# Altium schematic sheet MCU.SchDoc
size A4; SheetNumber: 1; SheetTotal: 5
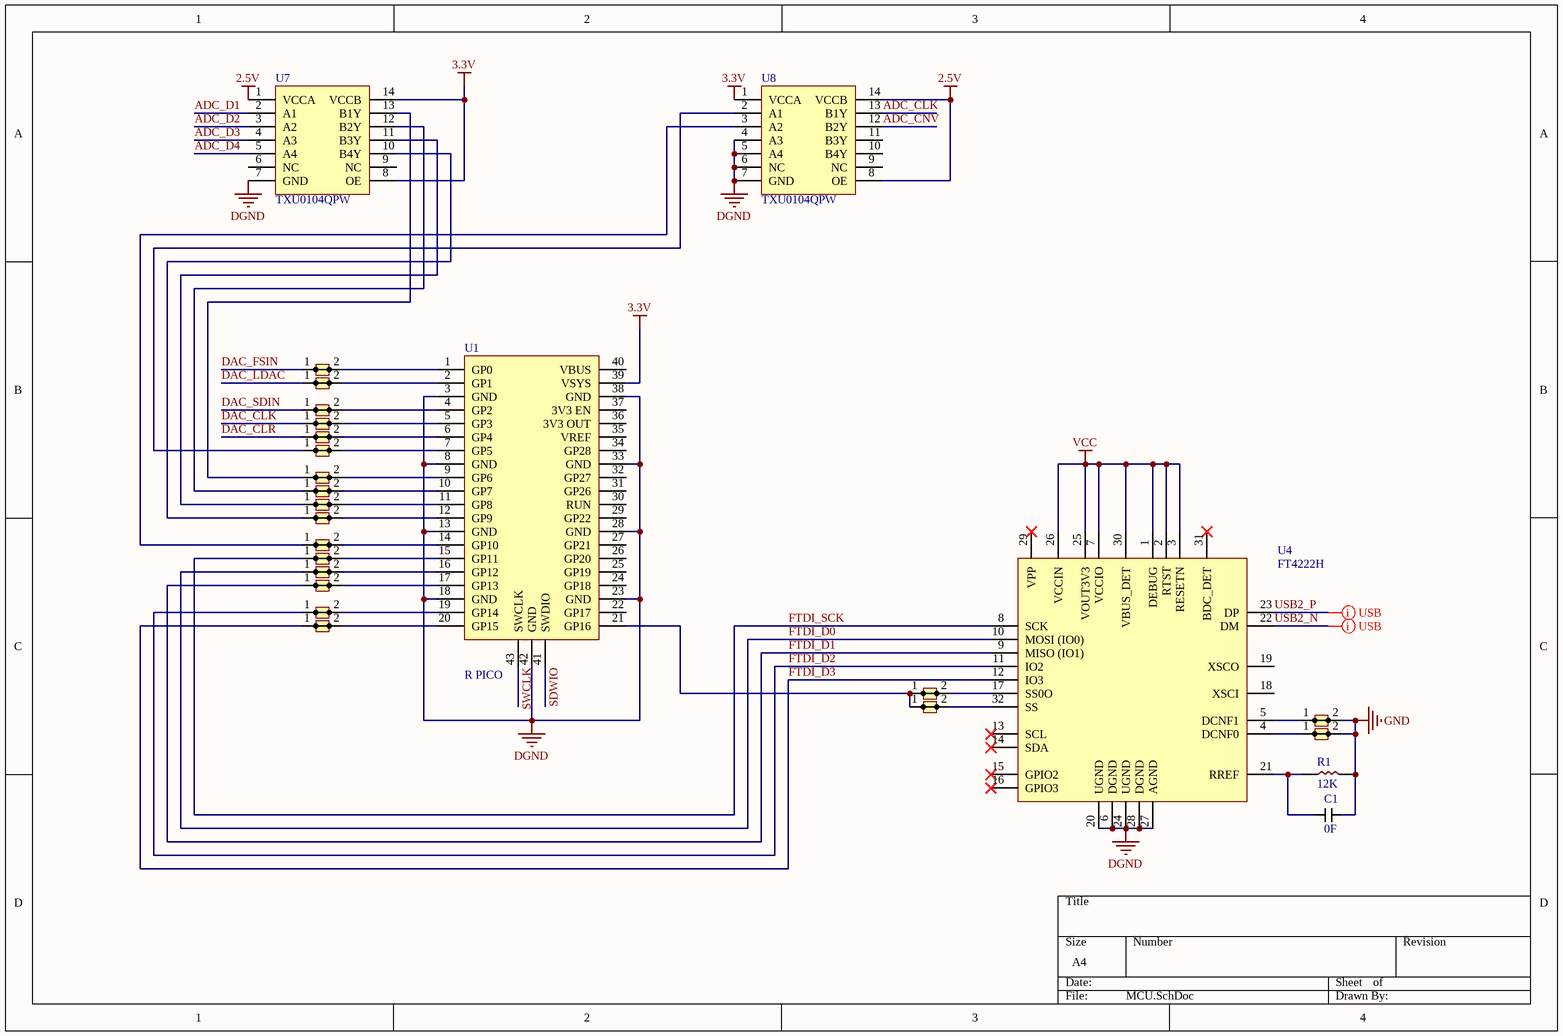
[diagram p0: MCU.SchDoc]

## Parts
C1  0F  [C0805]
R1  12K  [R0805]
SB1  SolderBridge  [SB]  (value not drawn)
SB2  SolderBridge  [SB]  (value not drawn)
SB3  SolderBridge  [SB]  (value not drawn)
SB4  SolderBridge  [SB]  (value not drawn)
SB5  SolderBridge  [SB]  (value not drawn)
SB6  SolderBridge  [SB]  (value not drawn)
SB7  SolderBridge  [SB]  (value not drawn)
SB8  SolderBridge  [SB]  (value not drawn)
SB9  SolderBridge  [SB]  (value not drawn)
SB10  SolderBridge  [SB]  (value not drawn)
SB11  SolderBridge  [SB]  (value not drawn)
SB12  SolderBridge  [SB]  (value not drawn)
SB13  SolderBridge  [SB]  (value not drawn)
SB14  SolderBridge  [SB]  (value not drawn)
SB15  SolderBridge  [SB]  (value not drawn)
SB16  SolderBridge  [SB]  (value not drawn)
SB17  SolderBridge  [SB]  (value not drawn)
SB18  SolderBridge  [SB]  (value not drawn)
SB19  SolderBridge  [SB]  (value not drawn)
SB20  SolderBridge  [SB]  (value not drawn)
U1  R PICO  [RPICO]
U4  FT4222H  [QFN-32]
U7  TXU0104QPW  [TSOP-14]
U8  TXU0104QPW  [TSOP-14]

## Nets
2.5V: U7.1(VCCA) U8.8(OE) U8.14(VCCB)
3.3V: U1.39(VSYS) U7.8(OE) U7.14(VCCB) U8.1(VCCA)
DGND: U1.3(GND) U1.8(GND) U1.13(GND) U1.18(GND) U1.23(GND) U1.28(GND) U1.33(GND) U1.38(GND) U1.42(GND) U4.6(DGND) U4.20(UGND) U4.24(UGND) U4.27(AGND) U4.28(DGND) U7.7(GND) U8.4(A3) U8.5(A4) U8.6(NC) U8.7(GND)
GND: C1.2 R1.2 SB19.2 SB20.2
VCC: U4.1(DEBUG) U4.2(RTST) U4.3(RESETN) U4.7(VCCIO) U4.25(VOUT3V3) U4.26(VCCIN) U4.30(VBUS_DET)
ADC_CLK: U8.13(B1Y)
ADC_CNV: U8.12(B2Y)
ADC_D1: U7.2(A1)
ADC_D2: U7.3(A2)
ADC_D3: U7.4(A3)
ADC_D4: U7.5(A4)
DAC_CLK: SB4.1
DAC_CLR: SB5.1
DAC_FSIN: SB1.1
DAC_LDAC: SB2.1
DAC_SDIN: SB3.1
FTDI_D0: SB13.1 U4.10(MOSI_(IO0))
FTDI_D1: SB14.1 U4.9(MISO_(IO1))
FTDI_D2: SB15.1 U4.11(IO2)
FTDI_D3: SB16.1 U4.12(IO3)
FTDI_SCK: SB12.1 U4.8(SCK)
SDWIO: U1.41(SWDIO)
SWCLK: U1.43(SWCLK)
USB2_N: U4.22(DM)
USB2_P: U4.23(DP)
NetC1_1: C1.1 R1.1 U4.21(RREF)
NetSB1_2: SB1.2 U1.1(GP0)
NetSB2_2: SB2.2 U1.2(GP1)
NetSB3_2: SB3.2 U1.4(GP2)
NetSB4_2: SB4.2 U1.5(GP3)
NetSB5_2: SB5.2 U1.6(GP4)
NetSB6_1: SB6.1 U8.2(A1)
NetSB6_2: SB6.2 U1.7(GP5)
NetSB7_1: SB7.1 U7.13(B1Y)
NetSB7_2: SB7.2 U1.9(GP6)
NetSB8_1: SB8.1 U7.12(B2Y)
NetSB8_2: SB8.2 U1.10(GP7)
NetSB9_1: SB9.1 U7.11(B3Y)
NetSB9_2: SB9.2 U1.11(GP8)
NetSB10_1: SB10.1 U7.10(B4Y)
NetSB10_2: SB10.2 U1.12(GP9)
NetSB11_1: SB11.1 U8.3(A2)
NetSB11_2: SB11.2 U1.14(GP10)
NetSB12_2: SB12.2 U1.15(GP11)
NetSB13_2: SB13.2 U1.16(GP12)
NetSB14_2: SB14.2 U1.17(GP13)
NetSB15_2: SB15.2 U1.19(GP14)
NetSB16_2: SB16.2 U1.20(GP15)
NetSB17_1: SB17.1 SB18.1 U1.21(GP16)
NetSB17_2: SB17.2 U4.17(SS0O)
NetSB18_2: SB18.2 U4.32(SS)
NetSB19_1: SB19.1 U4.5(DCNF1)
NetSB20_1: SB20.1 U4.4(DCNF0)

Not connected (* = marked no-connect by the designer): U1 22(GP17) 24(GP18) 25(GP19) 26(GP20) 27(GP21) 29(GP22) 30(RUN) 31(GP26) 32(GP27) 34(GP28) 35(VREF) 36(3V3_OUT) 37(3V3_EN) 40(VBUS); U4 13(SCL)* 14(SDA)* 15(GPIO2)* 16(GPIO3)* 18(XSCI) 19(XSCO) 29(VPP)* 31(BDC_DET)*; U7 6(NC) 9(NC); U8 9(NC) 10(B4Y) 11(B3Y)

## Layout directives
differential pair; differential pair class USB; rule Matched Net Lengths [Tolerance = 2mm]: USB2_N, USB2_P

## Library data of the parts
C1 = C0805: Capacitance: 0F
R1 = R0805: Resistance: 12K
U1 = RaspPico
U4 = FT4222H: USB2.0 to QuadSPI/I2C / Bridge IC; Supplier 1: Mouser; Supplier Part Number 1: 895-FT4222H-R
U7 U8 = TXU0104QPW: Supplier 1: Digi-Key; Supplier 2: Mouser; Supplier Part Number 1: 296-TXU0104QPWRQ1CT-ND; Supplier Part Number 2: 595-TXU0104QPWRQ1